# EAGLE schematic LEDTestBrd (EAGLE 6.5.0)
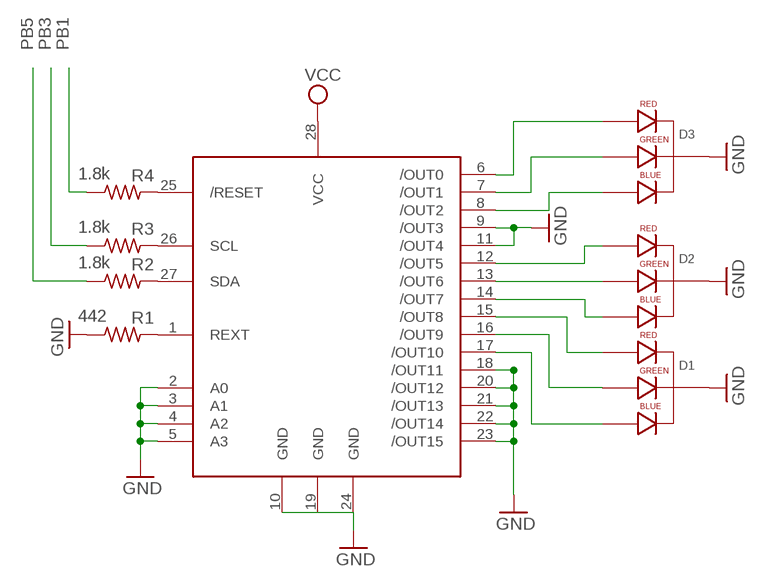
[diagram p0: schematic, sheet 1]

## Parts
D1  LED-RGB-CC-THRUCLEAR  [LED-RGB-THRU]
D2  LED-RGB-CC-THRUCLEAR  [LED-RGB-THRU]
D3  LED-RGB-CC-THRUCLEAR  [LED-RGB-THRU]
R1  442  R-US_R0402  [R0402]
R2  1.8k  R-US_R0402  [R0402]
R3  1.8k  R-US_R0402  [R0402]
R4  1.8k  R-US_R0402  [R0402]
U$2  TLC59116  [TSSOP28]

## Nets
GND: D1.2(CATHODE) D2.2(CATHODE) D3.2(CATHODE) R1.1 U$2.2(A0) U$2.3(A1) U$2.4(A2) U$2.5(A3) U$2.9(/OUT3) U$2.10(GND) U$2.11(/OUT4) U$2.18(/OUT11) U$2.19(GND) U$2.20(/OUT12) U$2.21(/OUT13) U$2.22(/OUT14) U$2.23(/OUT15) U$2.24(GND)
N$1: D3.1(RED_CATHODE) U$2.6(/OUT0)
N$2: D3.3(GREEN_CATHODE) U$2.7(/OUT1)
N$3: D3.4(BLUE_CATHODE) U$2.8(/OUT2)
N$4: D2.1(RED_CATHODE) U$2.12(/OUT5)
N$5: D2.3(GREEN_CATHODE) U$2.13(/OUT6)
N$6: D2.4(BLUE_CATHODE) U$2.14(/OUT7)
N$7: D1.1(RED_CATHODE) U$2.15(/OUT8)
N$8: D1.3(GREEN_CATHODE) U$2.16(/OUT9)
N$9: D1.4(BLUE_CATHODE) U$2.17(/OUT10)
N$10: R1.2 U$2.1(REXT)
N$11: R2.2 U$2.27(SDA)
N$12: R3.2 U$2.26(SCL)
N$13: R4.2 U$2.25(/RESET)
PB1: R4.1
PB3: R3.1
PB5: R2.1
VCC: U$2.28(VCC)

## Library data of the parts
D1-D3 = SparkFun-LED:LED-RGB-CC-THRU: RGB Through-hole common cathode LED SparkFun Storefront: COM-00105 (Clear) COM-09264 (Diffuse); PROD_ID: DIO-08418
R1-R4 = resistor:R-US_: RESISTOR, American symbol
U$2 = tlc59116:TLC59116